# EAGLE design slim bus mixer v1-4-layer (EAGLE 9.6.2)
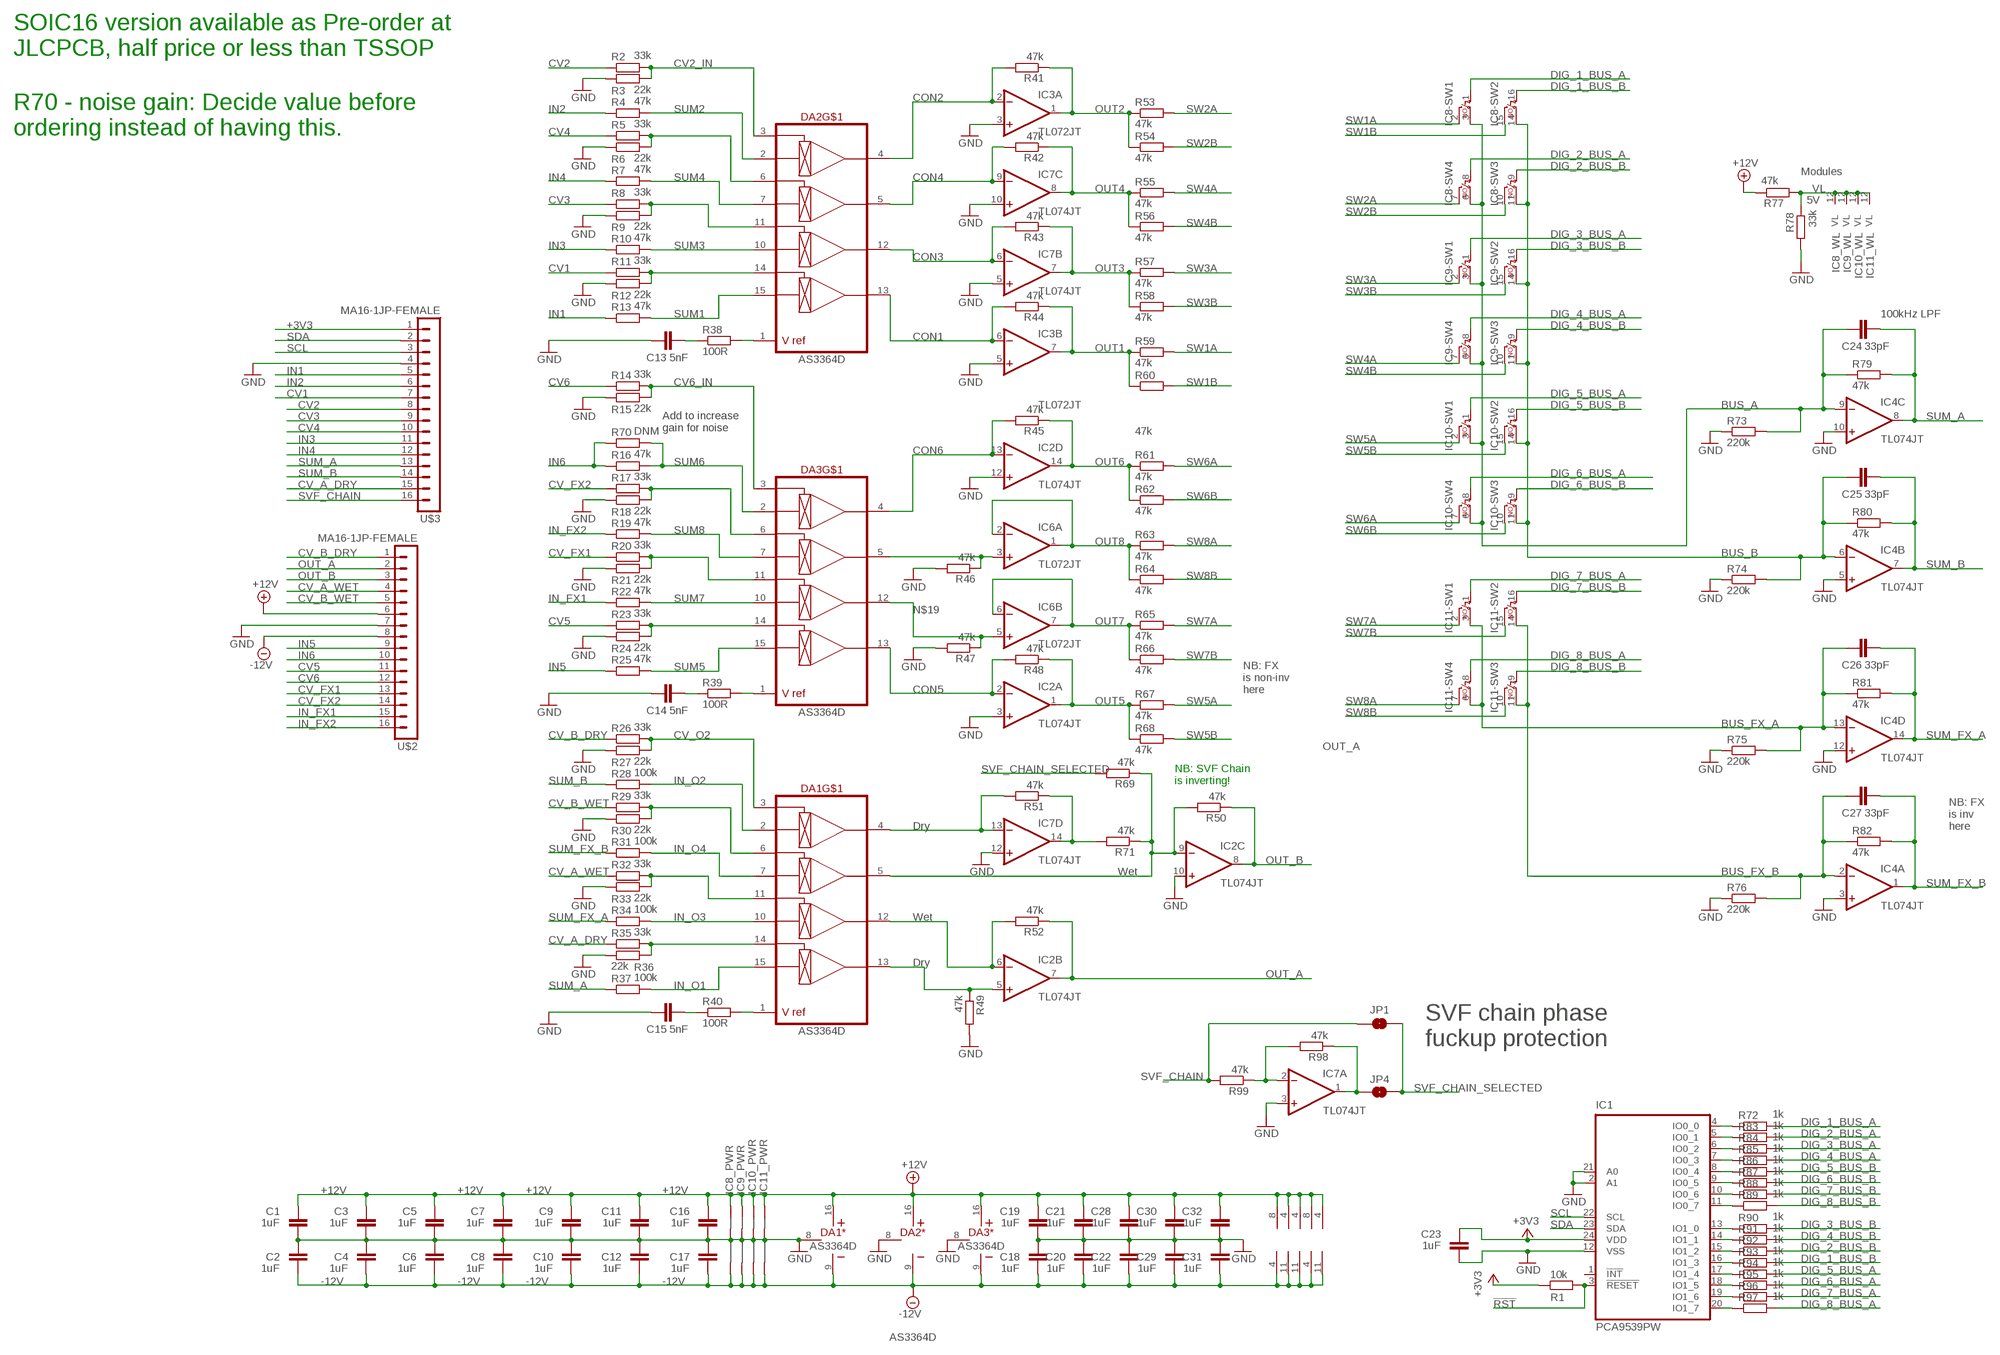
[diagram p0: schematic, sheet 1]

## Parts
C1  1uF  C-EU-J0402  [C0402-J]
C2  1uF  C-EU-J0402  [C0402-J]
C3  1uF  C-EU-J0402  [C0402-J]
C4  1uF  C-EU-J0402  [C0402-J]
C5  1uF  C-EU-J0402  [C0402-J]
C6  1uF  C-EU-J0402  [C0402-J]
C7  1uF  C-EU-J0402  [C0402-J]
C8  1uF  C-EU-J0402  [C0402-J]
C9  1uF  C-EU-J0402  [C0402-J]
C10  1uF  C-EU-J0402  [C0402-J]
C11  1uF  C-EU-J0402  [C0402-J]
C12  1uF  C-EU-J0402  [C0402-J]
C13  5nF  C-EU-J0402  [C0402-J]
C14  5nF  C-EU-J0402  [C0402-J]
C15  5nF  C-EU-J0402  [C0402-J]
C16  1uF  C-EU-J0402  [C0402-J]
C17  1uF  C-EU-J0402  [C0402-J]
C18  1uF  C-EU-J0402  [C0402-J]
C19  1uF  C-EU-J0402  [C0402-J]
C20  1uF  C-EU-J0402  [C0402-J]
C21  1uF  C-EU-J0402  [C0402-J]
C22  1uF  C-EU-J0402  [C0402-J]
C23  1uF  C-EU-J0402  [C0402-J]
C24  33pF  C-EU-J0402  [C0402-J]
C25  33pF  C-EU-J0402  [C0402-J]
C26  33pF  C-EU-J0402  [C0402-J]
C27  33pF  C-EU-J0402  [C0402-J]
C28  1uF  C-EU-J0402  [C0402-J]
C29  1uF  C-EU-J0402  [C0402-J]
C30  1uF  C-EU-J0402  [C0402-J]
C31  1uF  C-EU-J0402  [C0402-J]
C32  1uF  C-EU-J0402  [C0402-J]
DA1  AS3364D  [DIL16J]
DA2  AS3364D  [DIL16J]
DA3  AS3364D  [DIL16J]
IC1  PCA9539PW  [TSSOP24J]
IC2  TL074JT  [TSSOP14J]
IC3  TL072JT  [TSSOP8J]
IC4  TL074JT  [TSSOP14J]
IC6  TL072JT  [TSSOP8J]
IC7  TL074JT  [TSSOP14J]
IC8  DG412-JS  [SO-16]
IC9  DG412-JS  [SO-16]
IC10  DG412-JS  [SO-16]
IC11  DG412-JS  [SO-16]
JP1  JUMPER-SMT_2_NC_TRACE_SILK-DNM  JUMPER-SMT_2_NC_TRACE_SILK  [SMT-JUMPER_2_NC_TRACE_SILK]
JP4  JUMPER-SMT_2_NO_SILK-DNM  JUMPER-SMT_2_NO_SILK  [SMT-JUMPER_2_NO_SILK]
R1  10k  R-EU_R0402  [R0402]
R2  33k  R-EU_R0402  [R0402]
R3  22k  R-EU_R0402  [R0402]
R4  47k  R-EU_R0402  [R0402]
R5  33k  R-EU_R0402  [R0402]
R6  22k  R-EU_R0402  [R0402]
R7  47k  R-EU_R0402  [R0402]
R8  33k  R-EU_R0402  [R0402]
R9  22k  R-EU_R0402  [R0402]
R10  47k  R-EU_R0402  [R0402]
R11  33k  R-EU_R0402  [R0402]
R12  22k  R-EU_R0402  [R0402]
R13  47k  R-EU_R0402  [R0402]
R14  33k  R-EU_R0402  [R0402]
R15  22k  R-EU_R0402  [R0402]
R16  47k  R-EU_R0402  [R0402]
R17  33k  R-EU_R0402  [R0402]
R18  22k  R-EU_R0402  [R0402]
R19  47k  R-EU_R0402  [R0402]
R20  33k  R-EU_R0402  [R0402]
R21  22k  R-EU_R0402  [R0402]
R22  47k  R-EU_R0402  [R0402]
R23  33k  R-EU_R0402  [R0402]
R24  22k  R-EU_R0402  [R0402]
R25  47k  R-EU_R0402  [R0402]
R26  33k  R-EU_R0402  [R0402]
R27  22k  R-EU_R0402  [R0402]
R28  100k  R-EU_R0402  [R0402]
R29  33k  R-EU_R0402  [R0402]
R30  22k  R-EU_R0402  [R0402]
R31  100k  R-EU_R0402  [R0402]
R32  33k  R-EU_R0402  [R0402]
R33  22k  R-EU_R0402  [R0402]
R34  100k  R-EU_R0402  [R0402]
R35  33k  R-EU_R0402  [R0402]
R36  22k  R-EU_R0402  [R0402]
R37  100k  R-EU_R0402  [R0402]
R38  100R  R-EU_R0402  [R0402]
R39  100R  R-EU_R0402  [R0402]
R40  100R  R-EU_R0402  [R0402]
R41  47k  R-EU_R0402  [R0402]
R42  47k  R-EU_R0402  [R0402]
R43  47k  R-EU_R0402  [R0402]
R44  47k  R-EU_R0402  [R0402]
R45  47k  R-EU_R0402  [R0402]
R46  47k  R-EU_R0402  [R0402]
R47  47k  R-EU_R0402  [R0402]
R48  47k  R-EU_R0402  [R0402]
R49  47k  R-EU_R0402  [R0402]
R50  47k  R-EU_R0402  [R0402]
R51  47k  R-EU_R0402  [R0402]
R52  47k  R-EU_R0402  [R0402]
R53  47k  R-EU_R0402  [R0402]
R54  47k  R-EU_R0402  [R0402]
R55  47k  R-EU_R0402  [R0402]
R56  47k  R-EU_R0402  [R0402]
R57  47k  R-EU_R0402  [R0402]
R58  47k  R-EU_R0402  [R0402]
R59  47k  R-EU_R0402  [R0402]
R60  47k  R-EU_R0402  [R0402]
R61  47k  R-EU_R0402  [R0402]
R62  47k  R-EU_R0402  [R0402]
R63  47k  R-EU_R0402  [R0402]
R64  47k  R-EU_R0402  [R0402]
R65  47k  R-EU_R0402  [R0402]
R66  47k  R-EU_R0402  [R0402]
R67  47k  R-EU_R0402  [R0402]
R68  47k  R-EU_R0402  [R0402]
R69  47k  R-EU_R0402  [R0402]
R70  DNM  R-EU_R0805  [R0805]
R71  47k  R-EU_R0402  [R0402]
R72  1k  R-EU_R0402  [R0402]
R73  220k  R-EU_R0603  [R0603]
R74  220k  R-EU_R0603  [R0603]
R75  220k  R-EU_R0603  [R0603]
R76  220k  R-EU_R0603  [R0603]
R77  47k  R-EU_R0402  [R0402]
R78  33k  R-EU_R0402  [R0402]
R79  47k  R-EU_R0402  [R0402]
R80  47k  R-EU_R0402  [R0402]
R81  47k  R-EU_R0402  [R0402]
R82  47k  R-EU_R0402  [R0402]
R83  1k  R-EU_R0402  [R0402]
R84  1k  R-EU_R0402  [R0402]
R85  1k  R-EU_R0402  [R0402]
R86  1k  R-EU_R0402  [R0402]
R87  1k  R-EU_R0402  [R0402]
R88  1k  R-EU_R0402  [R0402]
R89  1k  R-EU_R0402  [R0402]
R90  1k  R-EU_R0402  [R0402]
R91  1k  R-EU_R0402  [R0402]
R92  1k  R-EU_R0402  [R0402]
R93  1k  R-EU_R0402  [R0402]
R94  1k  R-EU_R0402  [R0402]
R95  1k  R-EU_R0402  [R0402]
R96  1k  R-EU_R0402  [R0402]
R97  1k  R-EU_R0402  [R0402]
R98  47k  R-EU_R0402  [R0402]
R99  47k  R-EU_R0402  [R0402]
U$2  MA16-1JP-FEMALE  MA16-1JP  [SIP-PIN16-1J]
U$3  MA16-1JP-FEMALE  MA16-1JP  [SIP-PIN16-1J]

## Nets
!RST: IC1.3(!RESET) R1.2
+3V3: C23.2 IC1.24(VDD) R1.1 U$3.1
+12V: C1.2 C3.2 C5.2 C7.2 C9.2 C11.2 C16.2 C19.2 C21.2 C28.2 C30.2 C32.2 DA1.16(*:V+) DA2.16(*:V+) DA3.16(*:V+) IC2.4(P:V+) IC3.8(P:V+) IC4.4(P:V+) IC6.8(P:V+) IC7.4(P:V+) IC8.13(_PWR:+15V) IC9.13(_PWR:+15V) IC10.13(_PWR:+15V) IC11.13(_PWR:+15V) R77.1 U$2.6
-12V: C2.1 C4.1 C6.1 C8.1 C10.1 C12.1 C17.1 C18.1 C20.1 C22.1 C29.1 C31.1 DA1.9(*:V-) DA2.9(*:V-) DA3.9(*:V-) IC2.11(P:V-) IC3.4(P:V-) IC4.11(P:V-) IC6.4(P:V-) IC7.11(P:V-) IC8.4(_PWR:-15V) IC9.4(_PWR:-15V) IC10.4(_PWR:-15V) IC11.4(_PWR:-15V) U$2.8
BUS_A: C24.1 IC4.9(C:-IN) IC8.3(-SW1:S) IC8.6(-SW4:S) IC9.3(-SW1:S) IC9.6(-SW4:S) IC10.3(-SW1:S) IC10.6(-SW4:S) R73.2 R79.1
BUS_B: C25.1 IC4.6(B:-IN) IC8.11(-SW3:S) IC8.14(-SW2:S) IC9.11(-SW3:S) IC9.14(-SW2:S) IC10.11(-SW3:S) IC10.14(-SW2:S) R74.2 R80.1
BUS_FX_A: C26.1 IC4.13(D:-IN) IC11.3(-SW1:S) IC11.6(-SW4:S) R75.2 R81.1
BUS_FX_B: C27.1 IC4.2(A:-IN) IC11.11(-SW3:S) IC11.14(-SW2:S) R76.2 R82.1
CON1: DA2.13(OUT4) IC3.6(B:-IN) R44.2
CON2: DA2.4(OUT1) IC3.2(A:-IN) R41.2
CON3: DA2.12(OUT3) IC7.6(B:-IN) R43.2
CON4: DA2.5(OUT2) IC7.9(C:-IN) R42.2
CON5: DA3.13(OUT4) IC2.2(A:-IN) R48.2
CON6: DA3.4(OUT1) IC2.13(D:-IN) R45.2
CON_O1: DA1.12(OUT3) IC2.6(B:-IN) R52.2
CV1: R11.1 U$3.7
CV2: R2.1 U$3.8
CV2_IN: DA2.3(CV1) R2.2 R3.2
CV3: R8.1 U$3.9
CV4: R5.1 U$3.10
CV5: R23.1 U$2.11
CV6: R14.1 U$2.12
CV6_IN: DA3.3(CV1) R14.2 R15.2
CV_A_DRY: R35.1 U$3.15
CV_A_WET: R32.1 U$2.4
CV_B_DRY: R26.1 U$2.1
CV_B_WET: R29.1 U$2.5
CV_FX1: R20.1 U$2.13
CV_FX2: R17.1 U$2.14
CV_O2: DA1.3(CV1) R26.2 R27.2
DIG_1_BUS_A: IC8.1(-SW1:C) R72.2
DIG_1_BUS_B: IC8.16(-SW2:C) R93.2
DIG_2_BUS_A: IC8.8(-SW4:C) R83.2
DIG_2_BUS_B: IC8.9(-SW3:C) R92.2
DIG_3_BUS_A: IC9.1(-SW1:C) R84.2
DIG_3_BUS_B: IC9.16(-SW2:C) R90.2
DIG_4_BUS_A: IC9.8(-SW4:C) R85.2
DIG_4_BUS_B: IC9.9(-SW3:C) R91.2
DIG_5_BUS_A: IC10.1(-SW1:C) R94.2
DIG_5_BUS_B: IC10.16(-SW2:C) R86.2
DIG_6_BUS_A: IC10.8(-SW4:C) R95.2
DIG_6_BUS_B: IC10.9(-SW3:C) R87.2
DIG_7_BUS_A: IC11.1(-SW1:C) R96.2
DIG_7_BUS_B: IC11.16(-SW2:C) R88.2
DIG_8_BUS_A: IC11.8(-SW4:C) R97.2
DIG_8_BUS_B: IC11.9(-SW3:C) R89.2
GND: C1.1 C2.2 C3.1 C4.2 C5.1 C6.2 C7.1 C8.2 C9.1 C10.2 C11.1 C12.2 C13.1 C14.1 C15.1 C16.1 C17.2 C18.2 C19.1 C20.2 C21.1 C22.2 C23.1 C28.1 C29.2 C30.1 C31.2 C32.1 DA1.8(*:GND) DA2.8(*:GND) DA3.8(*:GND) IC1.2(A1) IC1.12(VSS) IC1.21(A0) IC2.3(A:+IN) IC2.10(C:+IN) IC2.12(D:+IN) IC3.3(A:+IN) IC3.5(B:+IN) IC4.3(A:+IN) IC4.5(B:+IN) IC4.10(C:+IN) IC4.12(D:+IN) IC7.3(A:+IN) IC7.5(B:+IN) IC7.10(C:+IN) IC7.12(D:+IN) IC8.5(_PWR:AGND) IC9.5(_PWR:AGND) IC10.5(_PWR:AGND) IC11.5(_PWR:AGND) R3.1 R6.1 R9.1 R12.1 R15.1 R18.1 R21.1 R24.1 R27.1 R30.1 R33.1 R36.1 R46.2 R47.2 R49.2 R73.1 R74.1 R75.1 R76.1 R78.2 U$2.7 U$3.4
IN1: R13.1 U$3.5
IN2: R4.1 U$3.6
IN3: R10.1 U$3.11
IN4: R7.1 U$3.12
IN5: R25.1 U$2.9
IN6: R16.1 R70.1 U$2.10
IN_FX1: R22.1 U$2.15
IN_FX2: R19.1 U$2.16
IN_O1: DA1.15(IN4) R37.2
IN_O2: DA1.2(IN1) R28.2
IN_O3: DA1.10(IN3) R34.2
IN_O4: DA1.7(IN2) R31.2
N$1: DA3.1(VREF) R39.2
N$2: DA2.1(VREF) R38.2
N$3: DA3.6(CV2) R17.2 R18.2
N$4: DA3.5(OUT2) IC6.3(A:+IN) R46.1
N$5: DA3.11(CV3) R20.2 R21.2
N$6: DA1.5(OUT2) IC2.9(C:-IN) R50.2 R69.1 R71.1
N$7: DA3.14(CV4) R23.2 R24.2
N$8: C14.2 R39.1
N$9: DA1.1(VREF) R40.2
N$10: DA2.6(CV2) R5.2 R6.2
N$11: DA1.6(CV2) R29.2 R30.2
N$12: DA2.11(CV3) R8.2 R9.2
N$13: DA1.11(CV3) R32.2 R33.2
N$14: C13.2 R38.1
N$15: DA1.14(CV4) R35.2 R36.2
N$16: C15.2 R40.1
N$17: DA1.4(OUT1) IC7.13(D:-IN) R51.2
N$18: DA1.13(OUT4) IC2.5(B:+IN) R49.1
N$19: DA3.12(OUT3) IC6.5(B:+IN) R47.1
N$20: IC7.14(D:OUT) R51.1 R71.2
N$21: DA2.14(CV4) R11.2 R12.2
N$22: IC7.1(A:OUT) JP4.1 R98.1
N$23: IC1.4(IO0_0) R72.1
N$24: IC1.5(IO0_1) R83.1
N$25: IC1.6(IO0_2) R84.1
N$26: IC1.7(IO0_3) R85.1
N$27: IC1.8(IO0_4) R86.1
N$28: IC1.9(IO0_5) R87.1
N$29: IC1.10(IO0_6) R88.1
N$30: IC1.11(IO0_7) R89.1
N$31: IC1.13(IO1_0) R90.1
N$32: IC1.14(IO1_1) R91.1
N$33: IC1.15(IO1_2) R92.1
N$34: IC1.16(IO1_3) R93.1
N$35: IC1.17(IO1_4) R94.1
N$36: IC1.18(IO1_5) R95.1
N$37: IC1.19(IO1_6) R96.1
N$38: IC1.20(IO1_7) R97.1
N$44: IC7.2(A:-IN) R98.2 R99.1
OUT1: IC3.7(B:OUT) R44.1 R59.1 R60.1
OUT2: IC3.1(A:OUT) R41.1 R53.1 R54.1
OUT3: IC7.7(B:OUT) R43.1 R57.1 R58.1
OUT4: IC7.8(C:OUT) R42.1 R55.1 R56.1
OUT5: IC2.1(A:OUT) R48.1 R67.1 R68.1
OUT6: IC2.14(D:OUT) R45.1 R61.1 R62.1
OUT7: IC6.6(B:-IN) IC6.7(B:OUT) R65.1 R66.1
OUT8: IC6.1(A:OUT) IC6.2(A:-IN) R63.1 R64.1
OUT_A: IC2.7(B:OUT) R52.1 U$2.2
OUT_B: IC2.8(C:OUT) R50.1 U$2.3
SCL: IC1.22(SCL) U$3.3
SDA: IC1.23(SDA) U$3.2
SUM1: DA2.15(IN4) R13.2
SUM2: DA2.2(IN1) R4.2
SUM3: DA2.10(IN3) R10.2
SUM4: DA2.7(IN2) R7.2
SUM5: DA3.15(IN4) R25.2
SUM6: DA3.2(IN1) R16.2 R70.2
SUM7: DA3.10(IN3) R22.2
SUM8: DA3.7(IN2) R19.2
SUM_A: C24.2 IC4.8(C:OUT) R37.1 R79.2 U$3.13
SUM_B: C25.2 IC4.7(B:OUT) R28.1 R80.2 U$3.14
SUM_FX_A: C26.2 IC4.14(D:OUT) R34.1 R81.2
SUM_FX_B: C27.2 IC4.1(A:OUT) R31.1 R82.2
SVF_CHAIN: JP1.1 R99.2 U$3.16
SVF_CHAIN_SELECTED: JP1.2 JP4.2 R69.2
SW1A: IC8.2(-SW1:D) R59.2
SW1B: IC8.15(-SW2:D) R60.2
SW2A: IC8.7(-SW4:D) R53.2
SW2B: IC8.10(-SW3:D) R54.2
SW3A: IC9.2(-SW1:D) R57.2
SW3B: IC9.15(-SW2:D) R58.2
SW4A: IC9.7(-SW4:D) R55.2
SW4B: IC9.10(-SW3:D) R56.2
SW5A: IC10.2(-SW1:D) R67.2
SW5B: IC10.15(-SW2:D) R68.2
SW6A: IC10.7(-SW4:D) R61.2
SW6B: IC10.10(-SW3:D) R62.2
SW7A: IC11.2(-SW1:D) R65.2
SW7B: IC11.15(-SW2:D) R66.2
SW8A: IC11.7(-SW4:D) R63.2
SW8B: IC11.10(-SW3:D) R64.2
VL: IC8.12(_WL:VL) IC9.12(_WL:VL) IC10.12(_WL:VL) IC11.12(_WL:VL) R77.2 R78.1
Unconnected: IC1.1(!INT)

## Notes on the sheet
- SOIC16 version available as Pre-order at
  JLCPCB, half price or less than TSSOP
- R70 - noise gain: Decide value before
  ordering instead of having this.
- Modules
- 5V
- 100kHz LPF
- Add to increase
  gain for noise
- NB: FX
  is non-inv
  here
- NB: SVF Chain
  is inverting!
- Dry
- NB: FX
  is inv
  here
- Wet
- Wet
- Dry
- SVF chain phase
  fuckup protection

## Library data of the parts
C1-C32 = joakim:C-EU-J: CAPACITOR, European symbol
DA1-DA3 = joakim:AS3364: AS3364 quad linear VCA, CEM3360 style. CV is 0 to 2V Vcc-Vee = 26V max, so +/-12V or +15V/-9V
IC1 = joakim:PCA9539: 16ch i/o expander. RPW version resets only internal statemachine to get out of stuck i2c-bus, other versions also reset outputs. Interrupt output requires external pull-up resistor for all variants. https://www.nxp.com/docs/en/data-sheet/PCA9539_PCA9539R.pdf
IC2 IC4 IC7 = joakim:TL074J: OP AMP
IC3 IC6 = joakim:TL072J: OP AMP
IC8-IC11 = joakim:DG412-J: Quad switch, normally open
JP1 = SparkFun-Jumpers:JUMPER-SMT_2_NC_TRACE: Normally closed trace jumper This jumper has a trace between two pads so it's normally closed (NC). Use a razor knife to open the connection. For best results follow the IPC guidelines for cutting traces: Cutout at least 0.063 mm (0.005 in). Remove all loose material to clean up the cut area. Seal the cut with an approved epoxy. Reapply solder to reclose the connection.
JP4 = SparkFun-Jumpers:JUMPER-SMT_2_NO: Normally open jumper This jumper has two pads in close proximity to each other. Apply solder to close the connection. Round pads are easier to solder for beginners, but are a lot larger. SparkFun Product that uses the round pads: SparkFun EL Sequencer <https://www.sparkfun.com/products/12781>
R1-R99 = rcl:R-EU_: RESISTOR, European symbol; SPICEPREFIX: R
U$2 U$3 = joakim:MA16-1J

## Board
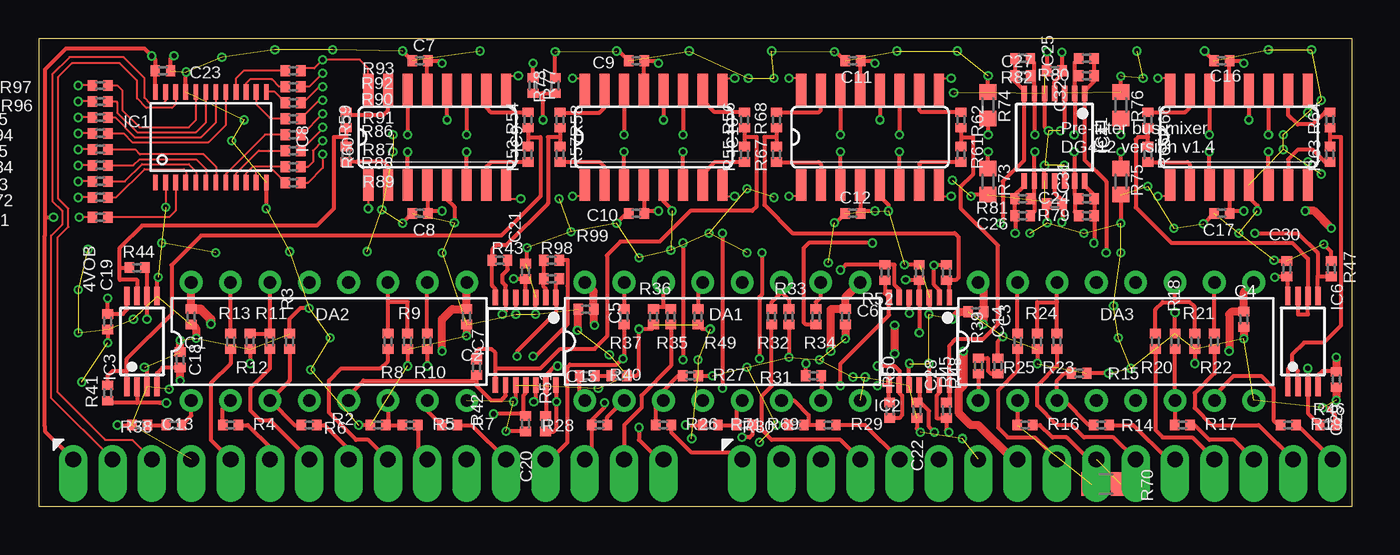
[diagram p1: board, top side]
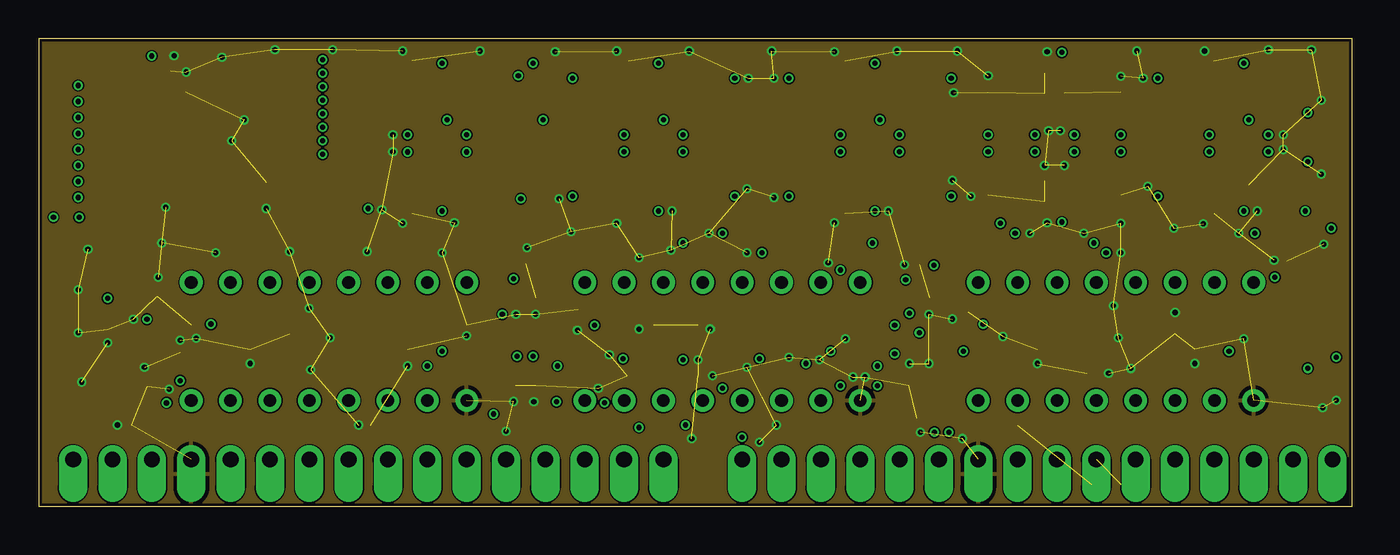
[diagram p2: board, inner layer Route2]
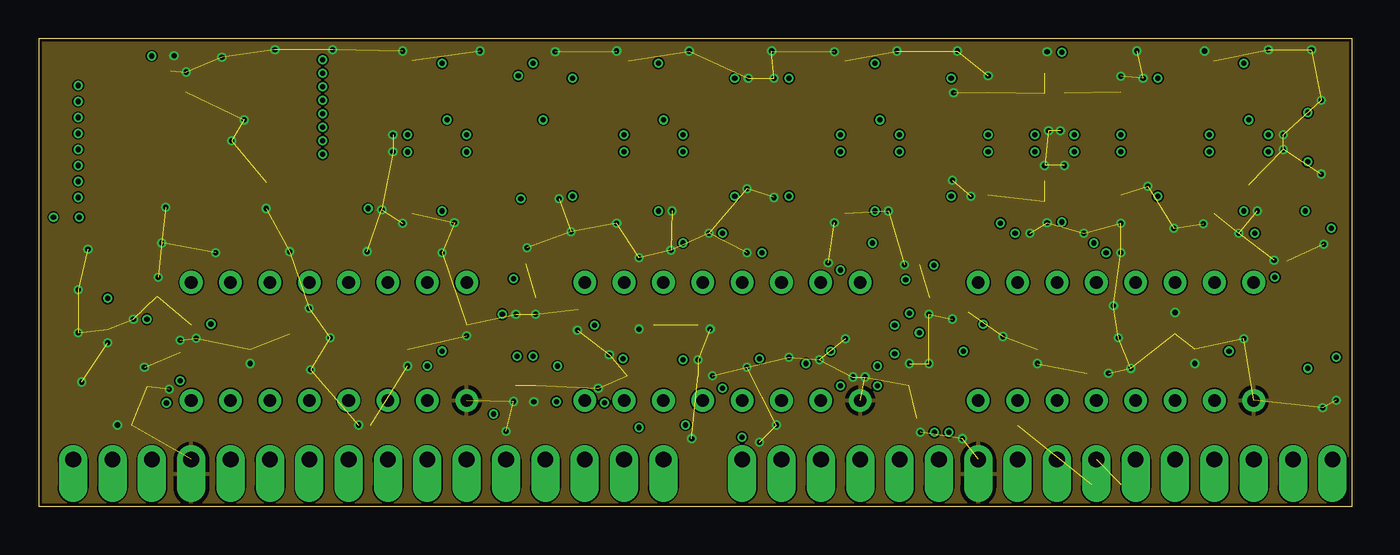
[diagram p3: board, inner layer Route15]
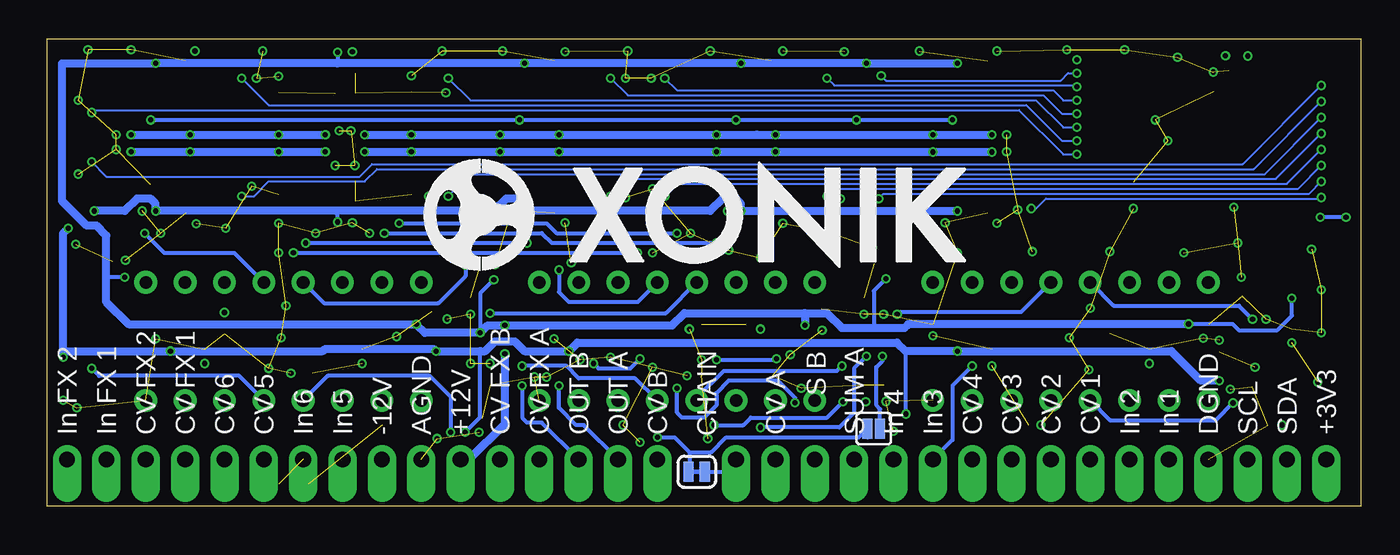
[diagram p4: board, bottom side, seen from below]

Size 84.77 x 30.16 mm. Coordinates in mm from the lower left corner, seen from the top.
Outline: 84.77,0 84.77,30.16 0,30.16 0,0 84.77,0
Copper layers (1+2*15+16): Top 0.035mm / dielectric 0.2mm / Route2 0.0175mm / dielectric 1.065mm / Route15 0.0175mm / dielectric 0.2mm / Bottom 0.035mm
Design rules "jlcpcb-4layers": minimum track width 3.5mil, minimum drill 0.2mm, track to track 3.5mil, track to pad 5mil, pad to pad 5mil, via to via 5mil, smd to smd 5mil, copper to edge 0.2mm, drill to drill 6mil, minimum pad ring 10mil, minimum via ring 0.13mm, stop-mask expansion 0.05mm, vias tented up to drill 16mil, thermal gap 10mil

### Footprints (pad centres in the part's own frame; a part is rotated, then mirrored left to right if it is on the bottom)
C0402-J = smd 0.6 x 0.7: 1 -0.5,0; 2 0.5,0
DIL16J = drill 0.813: 1 -8.89,-3.81; 2 -6.35,-3.81; 3 -3.81,-3.81; 4 -1.27,-3.81; 5 1.27,-3.81; 6 3.81,-3.81; 7 6.35,-3.81; 8 8.89,-3.81; 9 8.89,3.81; 10 6.35,3.81; 11 3.81,3.81; 12 1.27,3.81; 13 -1.27,3.81; 14 -3.81,3.81; 15 -6.35,3.81; 16 -8.89,3.81
TSSOP24J = smd 0.305 x 0.991: 1 -3.575,-2.918; 2 -2.925,-2.918; 3 -2.275,-2.918; 4 -1.625,-2.918; 5 -0.975,-2.918; 6 -0.325,-2.918; 7 0.325,-2.918; 8 0.975,-2.918; 9 1.625,-2.918; 10 2.275,-2.918; 11 2.925,-2.918; 12 3.575,-2.918; 13 3.575,2.918; 14 2.925,2.918; 15 2.275,2.918; 16 1.625,2.918; 17 0.975,2.918; 18 0.325,2.918; 19 -0.325,2.918; 20 -0.975,2.918; 21 -1.625,2.918; 22 -2.275,2.918; 23 -2.925,2.918; 24 -3.575,2.918
TSSOP14J = smd 0.35 x 1: 1 -1.95,-2.825; 2 -1.3,-2.825; 3 -0.65,-2.825; 4 0,-2.825; 5 0.65,-2.825; 6 1.3,-2.825; 7 1.95,-2.825; 8 1.95,2.825; 9 1.3,2.825; 10 0.65,2.825; 11 0,2.825; 12 -0.65,2.825; 13 -1.3,2.825; 14 -1.95,2.825
TSSOP8J = smd 1.2 x 0.35: 1 -2.925,0.975; 2 -2.925,0.325; 3 -2.925,-0.325; 4 -2.925,-0.975; 5 2.925,-0.975; 6 2.925,-0.325; 7 2.925,0.325; 8 2.925,0.975
SO-16 = smd 0.66 x 2.032: 1 -4.445,-3.073; 2 -3.175,-3.073; 3 -1.905,-3.073; 4 -0.635,-3.073; 5 0.635,-3.073; 6 1.905,-3.073; 7 3.175,-3.073; 8 4.445,-3.073; 9 4.445,3.073; 10 3.175,3.073; 11 1.905,3.073; 12 0.635,3.073; 13 -0.635,3.073; 14 -1.905,3.073; 15 -3.175,3.073; 16 -4.445,3.073
SMT-JUMPER_2_NC_TRACE_SILK = smd 0.66 x 1.27: 1 -0.521,0; 2 0.521,0
SMT-JUMPER_2_NO_SILK = smd 0.635 x 1.27: 1 -0.406,0; 2 0.406,0
R0402 = smd 0.6 x 0.7: 1 -0.5,0; 2 0.5,0
R0805 = smd 1.3 x 1.5: 1 -0.95,0; 2 0.95,0
R0603 = smd 1 x 1.1: 1 -0.85,0; 2 0.85,0
SIP-PIN16-1J = drill 1.016 offset: 1 -19.05,0; 2 -16.51,0; 3 -13.97,0; 4 -11.43,0; 5 -8.89,0; 6 -6.35,0; 7 -3.81,0; 8 -1.27,0; 9 1.27,0; 10 3.81,0; 11 6.35,0; 12 8.89,0; 13 11.43,0; 14 13.97,0; 15 16.51,0; 16 19.05,0

### Placement (x,y rotation side)
C1  9.84,12.22 90 top
C2  27.62,12.22 270 top
C3  60.48,12.54 0 top
C4  77.79,12.06 270 top
C5  35.32,12.7 0 top
C6  52.07,12.22 270 top
C7  24.61,28.73 0 top
C8  24.61,18.89 180 top
C9  38.58,28.73 0 top
C10  38.58,18.89 180 top
C11  52.55,28.73 0 top
C12  52.55,18.89 180 top
C13  6.51,5.24 0 top
C14  61.91,9.05 270 top
C15  37.47,8.41 180 top
C16  76.36,28.73 0 top
C17  76.36,18.89 180 top
C18  9.13,9.45 90 top
C19  4.45,11.91 90 top
C20  31.43,5.32 270 top
C21  31.43,15.16 270 top
C22  56.67,6.19 270 top
C23  8.02,28.1 180 top
C24  63.5,18.73 180 top
C25  63.5,28.89 180 top
C26  67.63,18.73 0 top
C27  67.63,28.89 0 top
C28  56.83,15.08 270 top
C29  83.74,8.18 270 top
C30  80.57,15.32 270 top
C31  65.56,19.53 180 top
C32  65.56,28.1 0 top
DA1  44.13,10.64 0 top
DA2  18.73,10.64 0 top
DA3  69.53,10.64 0 top
IC1  11.11,23.81 0 top
IC2  56.83,10.64 180 top
IC3  6.67,10.64 90 top
IC4  65.56,23.81 180 top
IC6  81.6,10.64 90 top
IC7  31.43,10.64 180 top
IC8  25.72,23.81 0 top
IC9  39.69,23.81 0 top
IC10  53.66,23.81 0 top
IC11  77.47,23.81 0 top
JP1  42.86,2.22 180 bottom
JP4  31.43,5 180 bottom
R1  3.97,18.65 0 top
R2  17.46,5.24 180 top
R3  16.19,10.64 270 top
R4  12.38,5.24 180 top
R5  23.97,5.24 180 top
R6  21.91,5.24 0 top
R7  26.51,5.24 180 top
R8  22.54,10.64 90 top
R9  23.81,10.64 90 top
R10  25.08,10.64 90 top
R11  14.92,10.64 90 top
R12  13.65,10.64 90 top
R13  12.38,10.64 90 top
R14  68.58,5.24 180 top
R15  67.15,8.57 180 top
R16  63.66,5.24 180 top
R17  73.82,5.24 180 top
R18  73.34,10.64 270 top
R19  80.64,5.24 180 top
R20  72.07,10.64 90 top
R21  74.61,10.64 90 top
R22  75.88,10.64 90 top
R23  65.72,10.64 90 top
R24  64.45,10.64 90 top
R25  63.18,10.64 90 top
R26  40.32,5.24 180 top
R27  42.07,8.41 180 top
R28  36.2,5.24 0 top
R29  50.96,5.24 180 top
R30  48.9,5.24 0 top
R31  50.01,8.41 0 top
R32  47.31,12.22 90 top
R33  48.42,12.22 90 top
R34  50.16,12.22 90 top
R35  40.8,12.22 90 top
R36  39.69,12.22 90 top
R37  37.78,12.22 90 top
R38  8.73,5.24 0 top
R39  60.64,9.05 270 top
R40  35.4,8.41 180 top
R41  4.45,7.3 270 top
R42  28.26,8.97 270 top
R43  29.77,15.88 0 top
R44  6.35,15.4 0 top
R45  58.58,6.19 270 top
R46  83.19,5.24 0 top
R47  83.42,15.32 90 top
R48  58.58,15.08 90 top
R49  42.55,12.22 270 top
R50  54.93,6.19 270 top
R51  32.7,5.32 90 top
R52  54.61,15.08 90 top
R53  31.59,22.7 270 top
R54  31.59,24.92 90 top
R55  45.56,22.7 270 top
R56  45.56,24.92 90 top
R57  33.66,22.7 270 top
R58  33.66,24.92 90 top
R59  19.84,22.7 270 top
R60  19.84,24.92 90 top
R61  59.53,22.7 270 top
R62  59.53,24.92 90 top
R63  83.34,22.7 270 top
R64  83.34,24.92 90 top
R65  71.6,22.7 270 top
R66  71.6,24.92 90 top
R67  47.62,22.7 270 top
R68  47.62,24.92 90 top
R69  45.56,5.24 0 top
R70  68.9,1.43 180 top
R71  43.34,5.24 180 top
R72  3.97,19.92 180 top
R73  61.28,20.95 90 top
R74  61.28,25.88 270 top
R75  69.85,20.95 90 top
R76  69.85,25.88 270 top
R77  31.91,27.15 270 top
R78  33.34,27.15 90 top
R79  63.5,19.84 180 top
R80  63.5,27.78 180 top
R81  67.63,19.84 0 top
R82  67.63,27.78 0 top
R83  3.97,20.95 180 top
R84  3.97,21.99 180 top
R85  3.97,23.02 180 top
R86  16.43,23.97 0 top
R87  16.43,22.94 0 top
R88  16.43,21.91 0 top
R89  16.43,20.88 0 top
R90  16.43,26.04 0 top
R91  16.43,25 0 top
R92  16.43,27.07 0 top
R93  16.43,28.1 0 top
R94  3.97,24.05 180 top
R95  3.97,25.08 180 top
R96  3.97,26.11 180 top
R97  3.97,27.15 180 top
R98  33.1,14.68 180 top
R99  33.1,15.88 0 top
U$1  [XONIK_LOGO_35]  60.48,15.24 0 bottom
U$2  64.45,3.02 0 top
U$3  21.27,3.02 0 top

### Tracks (layer width: path | path; a pad name or v marks a point on that pad's centre or on a via)
!RST
  Top 0.127: IC1.3 8.84,19.07 8.42,18.65 R1.2
+3V3  (via drill 0.33)
  Top 0.127: R1.1 v2.62,18.65
  Top 0.254: 0.4,5.16 0.4,17.46 0.4,18.65 | 0.4,18.65 0.4,28.18 1.75,29.53 6.83,29.53 v7.3,29.05 7.52,28.84 C23.2 7.52,26.75 IC1.24 | 0.4,5.16 | 0.4,5.16 0.4,4.84 U$3.1 | 0.4,18.65 v0.95,18.65
  Bottom 0.254: v0.95,18.65 v2.62,18.65
+12V  (via drill 0.33, 0.35)
  Top 0.254: 80.64,13.54 IC6.8 80.62,14.76 C30.2 79.83,14.82 v79.77,14.76 | v56.83,11.19 IC2.4 C28.2 56.81,14.61 v55.96,14.61 | v4.45,13.41 C19.2 5.42,12.41 5.69,12.68 IC3.8 | IC9.13 39.05,28.71 C9.2 39.85,28.73 v40.01,28.57 | IC8.13 25.08,28.71 C7.2 25.88,28.73 v26.03,28.57 | IC10.13 53.02,28.71 C11.2 53.82,28.73 v53.98,28.57 | IC11.13 76.83,28.71 C16.2 77.63,28.73 v77.79,28.57 | R77.1 v31.91,28.57 | v30.64,14.68 30.66,14.66 C21.2 IC7.4 | IC4.4 65.56,27.38 66.06,27.88 C32.2 66.06,29.27 v66.04,29.29
  Top 0.508: v55.24,11.67 v55.24,9.84 | DA3.16 60.98,14.11 C3.2 60.98,11.77 v60.96,11.75 | DA1.16 35.82,13.87 C5.2 35.82,11.72 v35.88,11.67 | C1.2 DA2.16
  Top 0.61: C1.2 10.45,12.72 11.11,12.06 v11.11,11.75
  Bottom 0.254: v4.45,13.41 4.45,12.3 5.38,11.36 7.88,11.36 8.26,11.75 v11.11,11.75 | v79.77,14.76 80.96,14.76 | v55.96,14.61 56.83,13.73 v56.83,11.19 | v30.64,14.68 31.43,13.89 31.43,11.51 | v66.04,29.29 66.04,28.57
  Bottom 0.508: v11.11,11.75 29.21,11.75 29.45,11.51 31.43,11.51 33.5,11.51 34.45,12.46 35.88,12.46 | 35.88,12.46 43.66,12.46 44.45,11.67 v55.24,11.67 56.36,11.67 v56.83,11.19 60.4,11.19 v60.96,11.75 79.53,11.75 80.96,13.18 80.96,14.76 80.96,17.46 81.6,18.1 82.23,18.1 83.82,19.68 83.82,28.57 v77.79,28.57 66.04,28.57 v53.98,28.57 v40.01,28.57 v31.91,28.57 v26.03,28.57 | 35.88,12.46 v35.88,11.67 | U$2.6 57.55,3.02 55.24,5.32 v55.24,9.84
-12V  (via drill 0.33, 0.35)
  Top 0.254: C18.1 7.99,8.95 7.64,8.6 IC3.4 | IC6.4 82.57,8.44 82.87,8.73 83.69,8.73 C29.1 | C20.1 31.3,5.95 | 31.3,5.95 v29.37,5.95 | IC7.11 31.43,7.3 31.27,7.14 31.27,5.98 31.3,5.95 | IC2.11 56.83,6.78 | 56.83,6.78 56.83,6.7 56.82,6.69 C22.1 | IC9.4 39.08,20.71 C10.1 39.23,19.05 v40.01,19.05 | IC8.4 25.11,20.71 C8.1 25.26,19.05 v26.03,19.05 | IC10.4 53.05,20.71 C12.1 53.2,19.05 v53.98,19.05 | IC11.4 76.86,20.71 C17.1 77.02,19.05 v77.79,19.05 | v57.82,4.76 57.47,5.12 57.47,6.14 56.83,6.78 | IC4.11 65.56,20.24 66.06,19.74 C31.1 66.06,18.36 v66.04,18.34
  Top 0.508: v26.03,10 26.03,12.06 26.69,12.72 C2.1 DA2.9 | U$2.8 62.87,3.02 60.64,5.24 60.17,5.24 59.37,6.03 59.37,7.46 59.69,7.78 v59.69,10 | DA3.9 77.79,13.81 C4.1 77.76,12.54 76.99,12.54 76.83,12.38 v76.83,10 | DA1.9 52.07,13.49 C6.1 52.05,12.7 51.12,12.7 v51.12,10 | v9.13,8.1 C18.1 | v83.74,9.6 C29.1 | v83.44,17.94 82.32,19.05 v81.76,19.05
  Bottom 0.254: v29.37,5.95 29.37,10 | v57.82,4.76 56.83,5.75 56.83,10 | v66.04,18.34 66.04,18.97 66.12,19.05
  Bottom 0.508: v26.03,10 12.22,10 10.32,8.1 v9.13,8.1 | v26.03,10 29.37,10 29.92,10.56 50.56,10.56 v51.12,10 53.98,10 54.61,10.64 55.88,10.64 56.51,10 56.83,10 v59.69,10 59.85,10.16 66.83,10.16 66.99,10 v76.83,10 83.74,10 | 25.88,10 v26.03,10 | v26.03,19.05 v40.01,19.05 40.01,19.53 40.32,19.84 41.2,19.84 41.99,19.05 v53.98,19.05 53.98,19.53 54.29,19.84 55.17,19.84 55.96,19.05 66.12,19.05 v77.79,19.05 77.79,19.53 78.11,19.84 78.98,19.84 79.77,19.05 v81.76,19.05 | v83.74,9.6 83.74,10 | 83.74,10 83.74,17.63 v83.44,17.94
BUS_A  (via drill 0.33)
  Top 0.254: IC9.6 v41.59,22.86 | IC8.3 v23.81,22.86 | IC8.6 v27.62,22.86 | IC10.3 v51.75,22.86 | IC10.6 v55.56,22.86 | v64.29,22.86 64.26,22.83 IC4.9 64.26,19.84 | 64.26,19.84 64.26,19 C24.1 | R79.1 64.26,19.84 | R73.2 v61.28,22.86 | IC9.3 v37.78,22.86
  Bottom 0.254: v27.62,22.86
  Bottom 0.508: v23.81,22.86 v23.82,22.86 v27.62,22.86 | v64.29,22.86 v61.28,22.86 v55.56,22.86 v51.75,22.86 v41.59,22.86 v37.78,22.86 v27.63,22.86 v27.62,22.86
BUS_B  (via drill 0.33)
  Top 0.254: IC8.14 v23.81,23.97 | IC8.11 v27.62,23.97 | v64.29,23.97 64.26,24 IC4.6 64.26,27.78 | 64.26,27.78 64.26,28.63 C25.1 | R80.1 64.26,27.78 | R74.2 v61.28,23.97 | IC10.11 v55.56,23.97 | IC9.14 v37.78,23.96 | IC9.11 v41.59,23.97 | IC10.14 v51.75,23.97
  Bottom 0.254: v37.78,23.97 v37.78,23.96 37.8,23.97 38.97,23.97
  Bottom 0.508: v23.81,23.97 v27.62,23.97 38.97,23.97 v41.59,23.97 v51.75,23.97 v55.56,23.97 v61.28,23.97 v64.29,23.97
BUS_FX_A  (via drill 0.33)
  Top 0.254: v66.83,22.86 66.86,22.83 IC4.13 66.86,20.11 | IC11.3 v75.56,22.86 | IC11.6 v79.37,22.86 | 66.86,20.11 66.86,19 C26.1 | R75.2 v69.85,22.86 | R81.1 66.86,20.11
  Bottom 0.508: v79.37,22.86 v75.56,22.86 v69.85,22.86 v66.83,22.86
BUS_FX_B  (via drill 0.33)
  Top 0.254: IC11.14 v75.56,23.97 | IC11.11 v79.37,23.97 | 66.86,27.78 66.86,28.63 C27.1 | R82.1 66.86,27.78 | R76.2 v69.85,23.97 | 66.86,27.78 IC4.2 66.86,24 v66.83,23.97
  Bottom 0.508: v79.37,23.97 v75.56,23.97 v69.85,23.97 v66.83,23.97
CON1  (via drill 0.33)
  Top 0.254: IC3.6 | R44.2 6.98,15.4 IC3.6 | v6.98,12.06 IC3.6
  Bottom 0.254: DA2.13 15.95,12.94 7.86,12.94 v6.98,12.06
CON2  (via drill 0.35)
  Top 0.254: 7.78,6.67 v8.26,6.67 6.35,6.67 | R41.2 4.58,6.67 6.35,6.67 | IC3.2 6.35,6.67
  Bottom 0.254: v8.26,6.67 9.37,5.56 16.19,5.56 DA2.4
CON3  (via drill 0.33)
  Top 0.254: v29.92,12.38 30.13,12.59 IC7.6 30.13,14.24 29.92,14.45 29.92,14.92 30.27,15.26 R43.2
  Bottom 0.254: DA2.12 21.91,12.54 29.92,12.54 v29.92,12.38
CON4
  Top 0.254: DA2.5 20,7.14 20.96,8.1 28.26,8.1 | IC7.9 30.13,7.13 30.02,7.02 30.02,7 29.84,6.83 29.21,6.83 28.26,7.78 28.26,8.1 | R42.2 28.26,8.1
CON5  (via drill 0.33)
  Top 0.254: R48.2 58.55,15.56 v57.79,15.56 57.79,14.29 58.13,13.94 IC2.2
  Bottom 0.254: DA3.13 66.91,13.1 59.53,13.1 57.79,14.84 v57.79,15.56
CON6  (via drill 0.33)
  Top 0.254: v58.74,4.76 58.71,4.76 58.58,4.9 R45.2 57.97,5.69 57.94,5.71 57.94,7.14 58.13,7.33 IC2.13
  Bottom 0.254: DA3.4 66.67,8.41 60.09,8.41 58.74,7.06 v58.74,4.76
CON_O1  (via drill 0.33)
  Top 0.254: IC2.6 55.53,14 55.24,14.29 55.24,15.56 55.22,15.58 R52.2 52.09,15.58 v51.75,15.24
  Bottom 0.254: DA1.12 46.67,13.18 51.12,13.18 51.75,13.81 v51.75,15.24
CV1
  Top 0.254: R11.1 14.92,8.89 13.65,7.62 13.65,6.19 14.29,5.56 14.92,5.56 U$3.7
CV2
  Top 0.254: R2.1 18.44,5.24 20,3.67 U$3.8
CV2_IN
  Top 0.254: R2.2 16.51,5.24 DA2.3 16.19,8.1 R3.2
CV3
  Top 0.254: U$3.9 21.27,4.29 20.48,4.29 18.73,6.03 18.73,8.1 19.53,8.89 22.07,8.89 22.54,9.37 R8.1
CV4
  Top 0.254: R5.1 24.47,3.63 U$3.10
CV5
  Top 0.254: R23.1 65.72,9.05 64.45,7.78 64.45,6.51 65.72,5.24 66.67,5.24 67.47,4.45 69.37,4.45 U$2.11
CV6
  Top 0.254: U$2.12 72.87,3.02 70.64,5.24 R14.1
CV6_IN
  Top 0.254: R14.2 67.79,5.24 66.2,6.83 DA3.3 65.72,8.1 66.2,8.57 R15.2
CV_A_DRY
  Top 0.254: R35.1 40.8,9.05 38.89,7.14 38.89,6.35 37.78,5.24 U$3.15
CV_A_WET
  Top 0.254: 52.88,3.16 52.15,3.89 51.75,4.29 47.31,4.29 46.67,4.92 46.67,7.12 47.31,7.75 R32.1 | 52.88,3.16 52.88,3.15 U$2.4 | 52.88,3.16 U$2.4
CV_B_DRY
  Top 0.254: R26.1 40.82,4.76 42.09,3.49 44.93,3.49 U$2.1
CV_B_WET
  Top 0.254: U$2.5 53.34,5.24 R29.1
CV_FX1
  Top 0.254: R20.1 72.07,4.92 72.55,4.45 74.45,4.45 U$2.13
CV_FX2
  Top 0.254: R17.1 74.61,5.24 75.56,4.29 77.15,4.29 U$2.14
CV_O2
  Top 0.254: R26.2 39.82,6.33 DA1.3 40.32,7.46 41.27,8.41 R27.2
DIG_1_BUS_A  (via drill 0.33)
  Top 0.127: 3.39,20 R72.2 v2.54,19.92 | 21.27,21.59 IC8.1 v21.27,19.21
  Bottom 0.127: v21.27,19.21 20.96,19.21 20.32,19.84 2.62,19.84 v2.54,19.92
DIG_1_BUS_B  (via drill 0.33)
  Top 0.127: 21.27,26.04 IC8.16 21.27,28.26 20.72,28.81 v18.34,28.81 17.78,28.26 17.09,28.26 R93.2
DIG_2_BUS_A  (via drill 0.33)
  Top 0.127: 30.28,21.71 30.16,21.59 IC8.8 30.16,19.84 v31.12,19.84 | R83.2 v2.54,20.95
  Bottom 0.127: v31.12,19.84 30.8,20.16 3.33,20.16 v2.54,20.95
DIG_2_BUS_B  (via drill 0.33)
  Top 0.127: 30.16,26.04 IC8.9 30.16,27.78 v30.96,27.78 | v18.34,27.94 17.46,27.07 R92.2
  Bottom 0.127: v30.96,27.78 30.64,27.46 19.37,27.46 18.89,27.94 v18.34,27.94
DIG_3_BUS_A  (via drill 0.33)
  Top 0.127: 35.24,21.59 IC9.1 35.24,20 v34.45,20 | 3.31,22.15 R84.2 v2.54,21.99
  Bottom 0.127: v34.45,20 33.97,20.48 4.05,20.48 v2.54,21.99
DIG_3_BUS_B  (via drill 0.33)
  Top 0.127: 35.08,26.04 35.24,26.19 IC9.16 35.24,27.62 v34.45,27.62 | v18.34,27.07 18.1,27.07 17.07,26.04 R90.2
  Bottom 0.127: v34.45,27.62 33.97,27.15 18.41,27.15 v18.34,27.07
DIG_4_BUS_A  (via drill 0.33)
  Top 0.127: 44.13,21.59 IC9.8 44.13,20 v44.93,20 | R85.2 v2.54,23.02
  Bottom 0.127: v44.93,20 44.13,20.8 4.76,20.8 v2.54,23.02
DIG_4_BUS_B  (via drill 0.33)
  Top 0.127: 44.29,26.04 44.13,26.19 IC9.9 44.13,27.62 v44.93,27.62 | v18.34,26.19 18.1,26.19 16.93,25.02 R91.2
  Bottom 0.127: v44.93,27.62 44.13,26.83 19.84,26.83 19.21,26.19 v18.34,26.19
DIG_5_BUS_A  (via drill 0.33)
  Top 0.127: IC10.1 49.21,20 v48.42,20 | 3.31,24.21 R94.2 v2.54,24.05
  Bottom 0.127: v48.42,20 47.31,21.11 5.48,21.11 v2.54,24.05
DIG_5_BUS_B  (via drill 0.33)
  Top 0.127: 49.21,26.04 IC10.16 49.21,27.62 v48.42,27.62 | v18.34,25.32 16.99,23.97 R86.2
  Bottom 0.127: v48.42,27.62 47.31,26.51 20.48,26.51 19.29,25.32 v18.34,25.32
DIG_6_BUS_A  (via drill 0.33)
  Top 0.127: 58.1,21.43 IC10.8 58.1,20 v58.9,20 | R95.2 v2.54,25.08
  Bottom 0.127: v58.9,20 57.47,21.43 6.19,21.43 v2.54,25.08
DIG_6_BUS_B  (via drill 0.33)
  Top 0.127: 58.1,26.04 IC10.9 58.1,27.62 v58.9,27.62 | v18.34,24.45 18.34,24.37 16.93,22.96 R87.2
  Bottom 0.127: v58.9,27.62 57.47,26.19 20.96,26.19 19.21,24.45 v18.34,24.45
DIG_7_BUS_A  (via drill 0.33)
  Top 0.127: 73.03,21.59 IC11.1 73.03,20 v72.23,20 | R96.2 v2.54,26.11
  Bottom 0.127: v72.23,20 71.44,20 70.48,20.95 64.29,20.95 63.5,21.75 6.91,21.75 v2.54,26.11
DIG_7_BUS_B  (via drill 0.33)
  Top 0.127: 73.03,26.04 IC11.16 73.03,27.62 v72.23,27.62 | v18.34,23.57 17.7,22.94 17.7,22.23 17.38,21.91 R88.2
  Bottom 0.127: v72.23,27.62 70.48,25.88 21.59,25.88 19.29,23.57 v18.34,23.57
DIG_8_BUS_A  (via drill 0.33)
  Top 0.127: 81.92,21.43 IC11.8 v81.92,22.23 | R97.2 v2.54,27.15
  Bottom 0.127: v81.92,22.23 80.96,21.27 64.61,21.27 63.82,22.07 7.62,22.07 v2.54,27.15
DIG_8_BUS_B  (via drill 0.33)
  Top 0.127: v18.34,22.7 18.34,21.83 17.38,20.88 R89.2 | 81.92,26.04 IC11.9 v81.92,25.4
  Bottom 0.127: v81.92,25.4 81.76,25.56 22.07,25.56 19.21,22.7 v18.34,22.7
GND  (via drill 0.33)  (137 unrouted)
  Top 0.127: IC1.2 v8.2,19.29
  Top 0.254: R36.1 39.69,11.56 39.55,11.43 v38.73,11.43 38.73,8.57 38.58,8.41 C15.1 | IC3.5 7.64,14.71 v7.7,14.76 | IC3.3 6.99,8.8 v6.83,8.97 | R9.1 v23.81,9.05 | IC7.3 32.08,12.4 v32.07,12.38 | IC7.5 30.78,12.4 v30.8,12.38 | v30.64,6.76 30.78,6.9 IC7.10 | IC7.12 32.08,6.88 v31.95,6.75 | R33.1 v48.42,9.6 | R49.2 42.84,11.43 v43.34,11.43 | C14.1 61.91,10.64 v62.23,10.95 | v69.06,8.57 R15.1 | v82.87,6.35 83.21,6.35 83.69,5.87 R46.2 | IC2.10 v56.18,9.21 v56.2,9.21 | IC2.12 57.48,9.19 v57.47,9.21 | IC2.3 57.48,12.4 v57.47,12.38 | R24.1 v64.45,9.21 | R21.1 v74.61,9.21 | R12.1 v13.65,9.21 | C23.1 8.52,28.84 v8.73,29.05 | IC1.12 v14.68,19.21 | IC1.21 9.49,27.98 v9.52,28.02 | C19.1 v4.45,10.56 | C20.2 31.41,4.84 v30.16,4.84 | R47.2 83.42,16.43 v82.95,16.91 | C30.1 79.79,15.82 v79.74,15.88 | C28.1 v55.88,15.57 | C21.1 31.51,15.76 v31.51,16.67 | v5.08,5.24 C13.1 | v17.46,12.78 16.88,12.78 16.19,12.09 R3.1 | R6.1 v20.64,5.24 | R27.1 v43.5,8.41 | R30.1 v47.62,5.24 | R18.1 v73.34,12.5 | C10.2 37.94,18.89 v37.31,18.26 | C8.2 23.5,18.28 v23.5,18.26 | C7.1 23.5,29.34 v23.5,29.37 | C9.1 37.44,29.37 v37.31,29.37 | C12.2 51.46,18.3 v51.36,18.3 | C11.1 51.46,29.32 v51.36,29.32 | C17.2 75.19,18.22 v75.17,18.22 | C16.1 75.25,29.34 v75.25,29.37 | R75.1 v69.85,18.26 | R76.1 v69.85,27.74 | C32.1 64.91,28.25 | R74.1 v61.28,27.78 | v78.66,19.05 78.66,19.39 78.11,19.95 IC11.5 | R73.1 60.27,20.11 v60.17,20 | IC10.5 54.29,20 54.85,19.45 v54.85,19.05 | IC9.5 40.32,19.68 40.88,19.13 v40.88,19.05 | IC8.5 26.35,19.79 26.83,19.31 v26.83,18.3 | R78.2 v33.34,29.32 | C22.2 56.67,5 v56.91,4.76 | 64.91,27.95 C32.1 | C32.1 65.09,28.12 v65.09,29.32 | IC4.5 64.91,24.49 v65.18,24.22 | IC4.3 66.21,24.49 v65.95,24.22
  Top 0.254: 64.91,19.68 C31.2 65.06,18.32 v65.09,18.3 | IC4.10 64.91,21.97 v64.93,21.99 | IC4.12 66.21,21.97 v66.2,21.99
  Top 0.508: 77.77,11.4 C4.2 v77.79,10.79 | C2.2 v27.62,11 | C6.2 v52.07,10.79 | C18.2 v9.13,10.72 | C29.2 v83.74,6.83 | v58.98,12.08 59.44,12.54 C3.1 | C5.1 34.82,12.62 34.77,12.56 v34.77,11.35 | C1.1 9.91,11.72 10.16,11.47 v10.16,10.84
  other vias: 8.41,7.54 6.11,12.06 36.12,7.62 42.55,9.45 36.83,9.76 45.72,8.97 50.4,9.45 46.51,4.13 42.15,4.37 59.61,4.37 77.47,17.62 69.85,16.35 67.47,17.62 63.98,17.62 45.72,16.35 43.26,17.62 40.8,16.51 18.97,29.45 22.15,19.13 33.58,19.84 47.47,19.92 45.72,20.48 58.98,21.03 59.05,26.67 47.47,27.62 45.8,27.62 71.28,27.62 71.6,20.64 82.79,26.19 82.79,21.43 80.33,23.97 80.33,23.02 22.86,23.97 22.86,22.86 52.55,8.33 53.34,8.33 50.96,15.72 15.24,29.45 11.83,28.97 13.26,24.92 12.46,23.57 3.18,16.59 2.54,13.97 2.54,11.19 2.78,8.02 7.94,16.99 11.43,16.35 16.19,16.43 21.19,16.43 26.04,16.35 17.54,8.81 18.81,10.87 34.37,17.7 38.73,16.03 69.37,12.94 69.69,10.87 70.48,8.89 73.26,17.94 28.5,29.37 41.99,29.37 47.31,29.37 55.4,29.37 59.29,29.37 70.88,29.37 79.38,29.45 82.15,29.45
  pour Route2: -0.32,37.15 85.09,37.15 85.09,0 -0.08,0 -0.32,0.24
  pour Route15: -1.27,37.47 85.88,37.47 85.88,0 -0.63,0 -0.63,36.83
IN1
  Top 0.254: R13.1 12.38,9.21 11.11,7.94 11.11,4.29 U$3.5
IN2
  Top 0.254: R4.1 13.49,5.24 14.92,3.81 U$3.6
IN3  (via drill 0.33)
  Top 0.254: R10.1 v25.08,9.05
  Bottom 0.254: v25.08,9.05 26.35,7.78 26.35,4.29 U$3.11
IN4
  Top 0.254: 27,5.23 R7.1 27.94,5.24 U$3.12
IN5
  Top 0.254: R25.1 63.18,8.73 61.91,7.46 61.91,5.08 62.55,4.45 64.29,4.45 U$2.9
IN6  (1 unrouted)
  Top 0.254: R16.1 64.63,5.24 65.43,4.45 66.36,4.45 67.79,3.02 U$2.10
IN_FX1
  Top 0.254: R22.1 75.88,8.57 74.61,7.3 74.61,6.35 75.72,5.24 78.74,5.24 U$2.15
IN_FX2
  Top 0.254: U$2.16 81.28,5.24 R19.1
IN_O1
  Top 0.254: DA1.15 R37.2
IN_O2
  Top 0.254: 36.69,5.25 R28.2 36.69,5.74 DA1.2
IN_O3
  Top 0.254: R34.2 50.16,13.18 50.48,13.49 DA1.10
IN_O4
  Top 0.254: 50.36,8.37 R31.2 50.51,6.85 DA1.7
N$1
  Top 0.254: R39.2 60.64,6.85 60.63,6.84 DA3.1
N$2
  Top 0.254: R38.2 9.84,5.85 DA2.1
N$3
  Top 0.254: 73.34,6.3 DA3.6 | R17.2 73.34,5.26 DA3.6 | DA3.6 R18.2
N$4  (via drill 0.33)
  Top 0.254: v81.92,8.89 IC6.3 81.92,6 R46.1
  Bottom 0.254: DA3.5 72.39,8.41 81.44,8.41 v81.92,8.89
N$5
  Top 0.254: 73.34,13.18 DA3.11 | R20.2 72.07,12.7 72.55,13.18 73.34,13.18 | R21.2 74.61,12.86 74.3,13.18 73.34,13.18
N$6  (via drill 0.33)
  Top 0.254: R71.1 R69.1 45.06,6.49 DA1.5 | R50.2 55.54,5.69 55.72,5.87 55.72,7.14 55.53,7.33 IC2.9 55.56,7.84 55.56,8.73 55.24,9.05 v54.13,9.05
  Bottom 0.254: DA1.5 46.83,8.26 50.48,8.26 51.28,9.05 v54.13,9.05
N$7
  Top 0.254: R23.2 65.72,13.18 | 65.72,13.18 DA3.14 | R24.2 64.45,13.18 65.72,13.18
N$8
  Top 0.254: R39.1 61.25,9.55 61.28,9.53 61.28,8.73 61.46,8.55 C14.2
N$9
  Top 0.254: DA1.1 34.92,7.14 34.9,7.14 R40.2
N$10
  Top 0.254: R5.2 R6.2 22.54,5.37 DA2.6
N$11
  Top 0.254: R29.2 49.69,5.24 | 49.69,5.24 R30.2 | DA1.6 48.74,6.83 49.69,5.87 49.69,5.24
N$12
  Top 0.254: R8.2 22.54,13.18 | 22.54,13.18 DA2.11 | R9.2 23.81,13.18 22.54,13.18
N$13
  Top 0.254: R32.2 47.31,13.18 47.94,13.81 | DA1.11 47.94,13.81 | 47.94,13.81 48.42,13.34 R33.2
N$14
  Top 0.254: C13.2 R38.1
N$15
  Top 0.254: R35.2 40.8,12.86 40.32,12.86 | 40.32,12.86 DA1.14 | R36.2 39.69,12.86 40.32,12.86
N$16
  Top 0.254: R40.1 C15.2
N$17  (via drill 0.33)
  Top 0.254: v33.5,9.05 33.34,9.05 32.73,8.44 IC7.13 32.73,5.85 R51.2
  Bottom 0.254: DA1.4 42.86,6.99 41.12,8.73 33.81,8.73 v33.5,9.05
N$18  (via drill 0.33)
  Top 0.254: v56.2,12.46 56.18,12.48 IC2.5 | R49.1 42.55,14.13 DA1.13
  Bottom 0.254: DA1.13 44.85,12.46 v56.2,12.46
N$19  (via drill 0.33)
  Top 0.254: IC6.5 82.55,13.58 82.55,14.82 | 82.55,14.82 82.55,16.35 81.28,17.62 v78.5,17.62 | R47.1 82.55,14.82
  Bottom 0.254: DA3.12 72.71,16.35 77.23,16.35 v78.5,17.62
N$20  (via drill 0.33)
  Top 0.254: v41.75,5.24 R71.2 | IC7.14 33.38,6.83 | 33.38,6.83 33.38,4.98 33.22,4.82 R51.1 | v33.42,6.75 33.42,6.79 33.38,6.83
  Bottom 0.254: v41.75,5.24 39.85,5.24 39.37,5.71 34.45,5.71 v33.42,6.75
N$21
  Top 0.254: DA2.14 R11.2 R12.2
N$22  (via drill 0.33)
  Top 0.254: R98.1 33.38,14.37 IC7.1 33.38,12.51 30.88,10 v30.88,9.68
  Bottom 0.254: v30.88,9.68 30.88,9.37 31.27,8.97 31.26,8.96 31.26,6.5 31.03,6.27 JP4.1
N$23
  Top 0.127: R72.1 5,19.92 6.83,21.75 9.37,21.75 9.52,21.59 9.52,20.93
  Top 0.254: 9.52,20.93 IC1.4
N$24
  Top 0.127: R83.1 5.56,20.95 6.67,22.07 9.68,22.07 10.16,21.59 10.16,20.92 IC1.5
N$25
  Top 0.127: R84.1 6.11,21.99 6.51,22.38 10.16,22.38 10.79,21.75 10.79,20.9 IC1.6
N$26
  Top 0.127: R85.1 6.22,23.02 6.53,22.7 10.64,22.7 11.44,21.9 IC1.7
N$27
  Top 0.127: IC1.8 12.09,21.45 14.6,23.97 R86.1
N$28
  Top 0.127: IC1.9 12.74,21.47 14.21,22.94 R87.1
N$29
  Top 0.127: IC1.10 13.39,21.48 13.81,21.91 R88.1
N$30
  Top 0.127: IC1.11 14.04,21.67 15.14,21.67 R89.1
N$31
  Top 0.127: R90.1 15.22,26.75 14.71,26.75 IC1.13
N$32
  Top 0.127: R91.1 14.98,25 14.04,25.94 IC1.14
N$33
  Top 0.127: R92.1 15.53,27.07 15.06,27.54 13.64,27.54 13.39,27.29 IC1.15
N$34
  Top 0.127: IC1.16 12.74,27.6 13.23,28.1 R93.1
N$35
  Top 0.127: R94.1 5.48,24.05 6.03,23.5 10.95,23.5 12.09,24.63 IC1.17
N$36
  Top 0.127: R95.1 4.92,25.08 6.19,23.81 10.48,23.81 11.44,24.77 IC1.18
N$37
  Top 0.127: IC1.19 10.79,24.77 10.16,24.13 6.35,24.13 5.08,25.4 5.08,26.04 5,26.11 R96.1
N$38
  Top 0.127: R97.1 5.08,27.15 5.4,26.83 5.4,25.56 6.51,24.45 9.68,24.45 10.16,24.92 10.16,26.71 IC1.20
N$44
  Top 0.254: IC7.2 32.73,14.02 32.6,14.15 R98.2 R99.1
OUT1
  Top 0.254: IC3.7 6.35,14.61 5.24,14.61 5.24,15.4 | 5.24,15.4 R44.1 | 5.24,15.4 5.24,16.67 6.67,18.1 17.94,18.1 19.05,19.21 19.05,23.81 19.84,23.81 | R60.1 19.84,23.81 | R59.1 19.84,23.81
OUT2
  Top 0.254: IC3.1 5.69,8.73 | 5.69,8.73 5.69,9.5 8.57,12.38 8.57,15.56 10.48,17.46 29.84,17.46 32.39,20 32.39,23.81 31.59,23.81 | R41.1 4.45,8.41 4.76,8.73 5.69,8.73 | R54.1 31.59,23.81 | 31.59,23.81 R53.1
OUT3
  Top 0.254: 29.37,16.04 29.37,16.03 29.27,15.93 R43.1 | R58.1 33.66,23.81 | 33.66,23.81 R57.1 | 33.66,23.81 32.86,23.81 32.86,19.53 30.16,16.83 29.53,16.83 29.27,16.57 R43.1 | IC7.7 29.48,14.02 29.27,14.23 R43.1
OUT4
  Top 0.254: 29.48,8.24 IC7.8 29.48,8.89 | R42.1 28.26,10 28.42,10.16 29.21,10.16 29.48,9.89 29.48,8.89 | 29.48,8.89 32.39,8.89 33.66,10.16 35.88,10.16 36.67,10.95 36.67,16.19 37.54,17.07 40.08,17.07 42.07,19.05 46.04,19.05 46.36,19.37 46.36,23.81 45.56,23.81 | R56.1 45.56,23.81 | 45.56,23.81 R55.1
OUT5
  Top 0.254: 58.78,13.86 IC2.1 58.78,14.38 R48.1 59.19,14.58 59.37,14.76 59.37,17.38 59.13,17.62 48.66,17.62 46.83,19.45 46.83,23.81 47.62,23.81 | R68.1 47.62,23.81 | 47.62,23.81 R67.1
OUT6
  Top 0.254: R45.1 58.78,6.69 IC2.14 58.78,10.36 59.21,10.79 60.96,10.79 61.91,11.75 61.91,16.83 59.53,19.21 59.53,20.64 60.33,21.43 60.33,23.81 59.53,23.81 | R62.1 59.53,23.81 | 59.53,23.81 R61.1
OUT7
  Top 0.254: 81.28,13.65 IC6.7 81.27,12.39 81.28,12.38 81.92,12.38 81.92,12.39 IC6.6 81.92,15.98 80.91,16.99 73.1,16.99 70.8,19.29 70.8,23.65 70.96,23.81 71.6,23.81 | 71.6,23.02 R65.1 71.6,23.81 | 71.6,23.81 R66.1
OUT8
  Top 0.254: IC6.1 80.62,8.87 80.88,9.13 | IC6.2 81.28,8.73 80.88,9.13 | 80.88,9.13 80.88,9.76 81.68,10.56 82.95,10.56 84.06,11.67 84.06,23.81 83.34,23.81 | R64.1 83.34,23.81 | 83.34,23.81 R63.1
OUT_A  (via drill 0.33)
  Top 0.254: 54.63,14.61 R52.1 54.61,13.73 IC2.7 54.88,12.34 51.75,9.21 v51.75,7.78
  Bottom 0.254: U$2.2 50.16,5.24 50.64,5.24 51.75,6.35 v51.75,7.78
OUT_B  (via drill 0.33)
  Top 0.254: IC2.8 54.88,8.3 | IC2.8 54.17,7.81 v54.13,7.78 | R50.1 54.88,6.74 IC2.8
  Bottom 0.254: U$2.3 52.86,5.4 53.82,5.4 54.13,5.71 v54.13,7.78
SCL
  Top 0.127: U$3.3 6.03,4.29 4.29,4.29 1.19,7.38 1.19,17.31 1.91,18.02 1.91,19.21 1.27,19.84 1.27,27.7 2.14,28.57 5.24,28.57 6.35,27.46 6.35,26.32 6.94,25.71 8.6,25.7 8.84,25.94 IC1.22
SDA
  Top 0.127: IC1.23 8.19,26.18 8.03,26.02 7.16,26.02 6.83,26.35 6.83,27.62 5.48,28.97 1.98,28.97 0.87,27.86 0.87,19.68 1.51,19.05 1.51,18.18 0.8,17.47 0.8,6.98 U$3.2
SUM1
  Top 0.254: R13.2 DA2.15
SUM2
  Top 0.254: R4.2 11.88,6.33 DA2.2
SUM3
  Top 0.254: R10.2 DA2.10
SUM4
  Top 0.254: R7.2 25.08,6.17 DA2.7
SUM5
  Top 0.254: R25.2 DA3.15
SUM6  (1 unrouted)
  Top 0.254: DA3.2 63.18,5.26 R16.2
SUM7
  Top 0.254: R22.2 DA3.10
SUM8
  Top 0.254: DA3.7 75.88,7.14 77.15,8.41 78.9,8.41 79.69,7.62 79.69,5.56 80.01,5.24 R19.2
SUM_A  (via drill 0.33)
  Top 0.254: v41.59,16.99 v41.59,9.45 | U$3.13 33.02,3.02 34.13,4.13 34.13,8.97 34.29,9.13 37.31,9.13 v37.7,9.53 37.78,9.6 R37.1 | v63.02,17.62 63.02,18.71 C24.2 R79.2 62.89,19.96 63.61,20.68 IC4.8
  Bottom 0.254: v37.7,9.53 37.78,9.45 v41.59,9.45 | v63.02,17.62 52.86,17.62 52.23,16.99 v41.59,16.99
SUM_B  (via drill 0.33)
  Top 0.254: v44.13,17.62 v44.13,7.62 | U$3.14 35.69,3.47 R28.1 35.69,5.56 36.51,6.37 v36.51,6.67 | C25.2 R80.2 | R80.2 63,27.62 | v62.07,18.26 62.23,18.41 62.23,20.95 63.61,22.34 IC4.7 63.61,26.8 63,27.41 R80.2
  Bottom 0.254: v44.13,7.62 44.13,6.03 43.81,5.71 42.39,5.71 41.59,6.51 41.59,7.3 40.8,8.1 37.62,8.1 36.51,6.99 v36.51,6.67 | v62.07,18.26 52.55,18.26 51.91,17.62 v44.13,17.62
SUM_FX_A  (via drill 0.33)
  Top 0.254: 67.51,20.83 67.55,20.8 67.55,20.64 | v53.82,16.99 49.71,16.99 49.37,16.64 49.37,11.88 49.53,11.72 R34.1 | 68.24,19.96 R81.2 | R81.2 68.13,20.06 67.71,20.48 67.55,20.64 | R81.2 C26.2 68.13,16.99 v68.1,16.99 | IC4.14 67.51,20.67 67.55,20.64
  Bottom 0.254: v68.1,16.99 v53.82,16.99
SUM_FX_B  (via drill 0.33)
  Top 0.254: R31.1 49.51,9.18 v49.53,9.21 | C27.2 R82.2 68.13,27.41 67.51,26.8 IC4.1 67.51,22.34 68.9,20.95 v68.9,16.35 | v46.67,16.35 46.67,13.65 46.51,13.49 v46.51,9.53
  Bottom 0.254: v49.53,9.21 49.21,8.89 47.15,8.89 v46.51,9.53 | v68.9,16.35 v46.67,16.35
SVF_CHAIN  (via drill 0.33)
  Top 0.254: v31.91,9.68 32.06,9.68 34.13,11.76 34.13,14.21 34.15,14.23 34.15,15.88 R99.2 | v38.73,5.08 38.73,4.29 40.01,3.02 U$3.16
  Bottom 0.254: 42.34,2.65 JP1.1 41.12,2.22 U$3.16 | v31.91,9.68 32.7,8.89 32.7,6.03 33.66,5.08 v38.73,5.08
SVF_CHAIN_SELECTED  (via drill 0.33)
  Top 0.254: 46.13,5.17 R69.2 46.06,4.63 45.88,4.45 v45.4,4.45
  Bottom 0.254: 31.84,4.45 JP4.2 32.39,4.45 40.96,4.45 41.91,3.49 43.34,3.49 | v45.4,4.45 44.29,4.45 43.34,3.49 | 43.34,3.49 43.34,2.27 JP1.2
SW1A
  Top 0.254: IC8.2 22.54,21.91 22.3,22.23 20.5,22.23 R59.2
SW1B
  Top 0.254: R60.2 20.2,25.24 22.23,25.24 22.54,25.56 IC8.15
SW2A
  Top 0.254: R53.2 29.19,22.2 28.89,21.91 IC8.7
SW2B
  Top 0.254: R54.2 31.57,25.4 29.21,25.4 28.89,25.72 IC8.10
SW3A
  Top 0.254: R57.2 33.67,22.21 34,22.23 36.19,22.23 36.51,21.91 IC9.2
SW3B
  Top 0.254: R58.2 33.76,25.4 36.19,25.4 36.51,25.72 IC9.15
SW4A
  Top 0.254: R55.2 43.63,22.2 42.86,21.43 IC9.7
SW4B
  Top 0.254: R56.2 43.63,25.42 42.86,26.19 IC9.10
SW5A
  Top 0.254: IC10.2 50.48,22.07 50.35,22.2 R67.2
SW5B
  Top 0.254: IC10.15 50.48,25.56 50.32,25.4 47.65,25.4 R68.2
SW6A
  Top 0.254: R61.2 56.97,22.2 56.83,22.07 IC10.7
SW6B
  Top 0.254: R62.2 56.97,25.42 56.83,25.56 IC10.10
SW7A
  Top 0.254: R65.2 74.16,22.2 74.3,22.07 IC11.2
SW7B
  Top 0.254: R66.2 74,25.42 74.3,25.72 IC11.15
SW8A
  Top 0.254: R63.2 83.03,22.2 82.23,23 81.26,23 80.64,22.38 IC11.7
SW8B
  Top 0.254: R64.2 83.03,25.42 82.23,24.63 81.26,24.63 80.64,25.24 IC11.10
VL  (via drill 0.33)
  Top 0.254: v26.35,24.92 IC8.12 | IC9.12 v40.32,24.92 | IC10.12 v54.29,24.92 | IC11.12 v78.11,24.92 | R77.2 32.54,26.65 | 32.54,26.65 R78.1 | v32.54,24.92 32.54,26.65
  Bottom 0.254: v26.35,24.92 v32.54,24.92 v40.32,24.92 v54.29,24.92 v78.11,24.92

### Text on the board
tNames: Pre-filter bus mixer / DG412 version v1.4 | 4VOB
bNames: S B | +3V3 | SDA | SCL | DGND | In 1 | In 2 | CV 1 | CV 2 | CV 3 | CV 4 | In 3 | In 4 | SUM A | CV A | CHAIN | CV B | OUT A | OUT B | CV FX A | CV FX B | +12V | AGND | -12V | In 5 | In 6 | CV 5 | CV 6 | CV FX 1 | CV FX 2 | In FX 1 | In FX 2